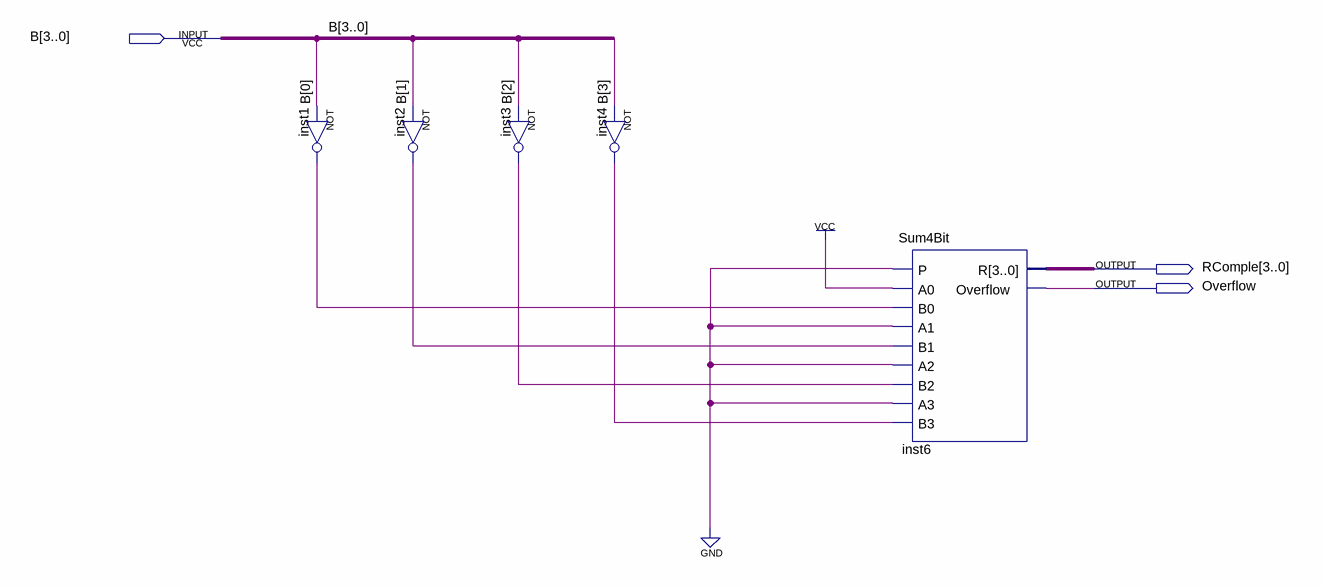
[diagram p0: schematic sheet]
// Quartus schematic Complemento2.bdf as structural Verilog: 5 symbols, 3 pins
module Complemento2 (
  input  [3:0] B,
  output [3:0] RComple,
  output Overflow
);

  wire inst1_out, inst2_out, inst3_out, inst4_out;

  not inst1 (inst1_out, B[0]);
  not inst2 (inst2_out, B[1]);
  not inst3 (inst3_out, B[2]);
  not inst4 (inst4_out, B[3]);
  Sum4Bit inst6 (
    .P(1'b0), .A0(1'b1), .B0(inst1_out), .A1(1'b0), .B1(inst2_out), .A2(1'b0), .B2(inst3_out), .A3(1'b0),
    .B3(inst4_out), .R(RComple), .Overflow(Overflow));
endmodule
